# Altium schematic sheet V2.0.SchDoc
size 127 x 81 mm
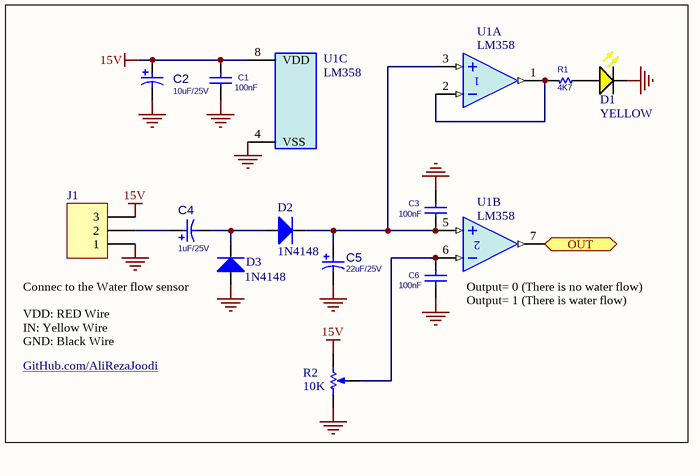
[diagram p0: V2.0.SchDoc]

## Parts
C1  100nF  [C_THD_CER_(P2.54-D3.5-T1.5)]
C2  10uF/25V  [C_THD_EL_(P2.54-D6-H11)]
C3  100nF  [C_THD_CER_(P2.54-D3.5-T1.5)]
C4  1uF/25V  [C_THD_EL_(P2.54-D6-H11)]
C5  22uF/25V  [C_THD_EL_(P2.54-D6-H11)]
C6  100nF  [C_THD_CER_(P2.54-D3.5-T1.5)]
D1  YELLOW  [LED_THD_5MM_YELLOW]
D2  1N4148  [D_THD_AXIAL0.3_DO-35]
D3  1N4148  [D_THD_AXIAL0.3_DO-35]
J1  3PIN  [Connector_Phoenix_3PIN_MSTB]  (value not drawn)
R1  4K7  [R_THD_AXIAL0.4(1/4W)]
R2  10K  [POT_THD_3296W]
U1  LM358  [751-02_L]  (parts A,B,C of 3)

## Ports
OUT (out)

## Nets
15V: C1.1 C2.1 J1.3 R2.3(BOT) U1.8(VDD)
GND: C1.2 C2.2 C3.2 C5.2 C6.2 D1.2(K) D3.1(A) J1.1 R2.1(TOP) U1.4(VSS)
OUT: U1.7(OUT) ; port OUT
NetC3_1: C3.1 C5.1 D2.2(K) U1.3(IN+) U1.5(IN+)
NetC4_1: C4.1 J1.2
NetC4_2: C4.2 D2.1(A) D3.2(K)
NetC6_1: C6.1 R2.2(TAP) U1.6(IN-)
NetD1_1: D1.1(A) R1.2
NetR1_1: R1.1 U1.1(OUT) U1.2(IN-)

## Notes on the sheet
- Output= 0 (There is no water flow)
  Output= 1 (There is water flow)
- Connec to the Water flow sensor
  VDD: RED Wire
  IN: Yellow Wire
  GND: Black Wire
- GitHub.com/AliRezaJoodi

## Library data of the parts
C1 C3 C6 = Capacitor_Ceramic: Capacitor, Ceramic Multilayer
C2 C4 C5 = Capacitor_Electrolytic: Capacitor, Electrolytic
D1 = LED_YELLOW: LED, Yellow; Manufacturer: Generic Components; Class I: Optoelectronic; Published: 8-Jun-2000; Revision: July-2002: Re-released for DXP Platform.; Publisher: Altium Limited; Class II: LED
D2 D3 = Diode: Default Diode; Manufacturer: Generic Components; Class I: Discrete; Class II: Diode - Switching; Published: 8-Jun-2000; Revision: July-2002: Re-released for DXP Platform.; Publisher: Altium Limited
J1 = Header 3: Header, 3-Pin; Manufacturer: Generic Components; Class I: Connector; Revision: July-2002: Re-released for DXP Platform.; Publisher: Altium Limited
R1 = Resistor: Resistor,
R2 = Resistor_Pot: Potentiometer; Revision: July-2002: Re-released for DXP Platform.
U1 = LM358: Dual Low-Power Operational Amplifier; Published: 17-Jul-2002; LatestRevisionDate: 13-Apr-2006; LatestRevisionNote: IPC-7351 Footprint Added.; DatasheetVersion: 1988; PackageReference: 751-02; Publisher: Altium Limited; PackageDescription: 8-Pin Small Outline Integrated Circuit 1.27 mm Pitch; Code_JEDEC: MS-012-AA; Code_IPC: SOIC127P600-8; ComponentLink1Description: Manufacturer Link; ComponentLink1URL: http://www.onsemi.com/site/products/parametrics/0,4446,251,00.html; ComponentLink2Description: Datasheet; ComponentLink2URL: http://www.onsemi.com/pub/Collateral/LM358-D.PDF